# EAGLE design Grove - I2C Color sensor v1.2 (EAGLE 6.3)
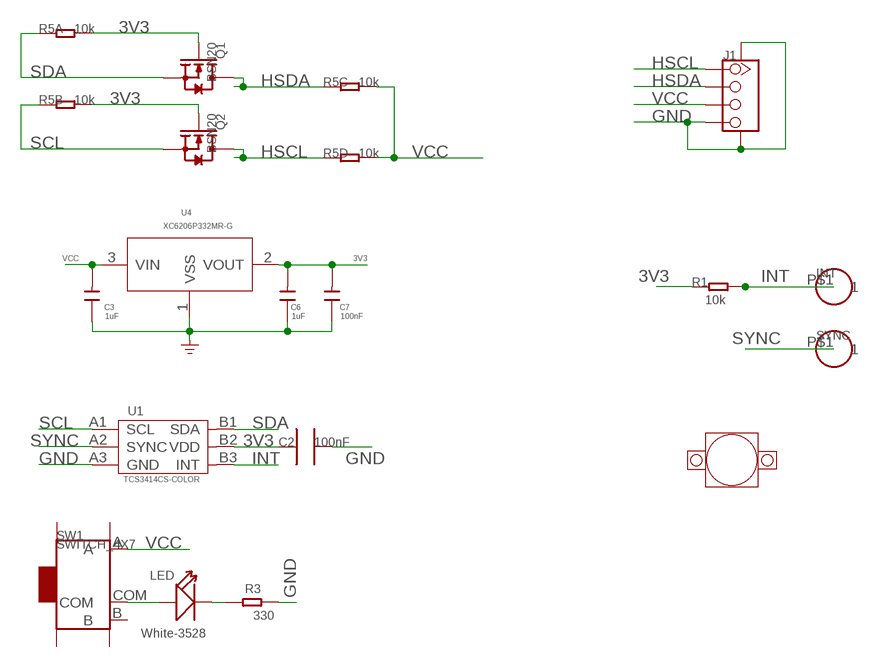
[diagram p0: schematic, sheet 1]

## Parts
C2  100nF  C0603_S  [0603_S]
C3  1uF  C-0603  [C0603]
C6  1uF  C-0603  [C0603]
C7  100nF  C-0603  [C0603]
INT  CK_1X132  [CK_1X1]
J1  TWIG-4P-2.0-SMD-FEMALE-REINFORCE'DD'  [4P-SMD-2.0]
LED  White-3528  007-LED1.6*2.7  [LED1210]
Q1  BSN20  MOSFET-N'SOT23'  [SOT23]
Q2  BSN20  MOSFET-N'SOT23'  [SOT23]
R1  10k  R0603  [0603]
R3  330  R0603  [0603]
R5  10k  005-4R_1206  [R1206-8]
SW1  SWITCH_4X7  [4*8_SW]
SYNC  CK_1X132  [CK_1X1]
U1  TCS3414CS-COLOR  [TCS3414CS]
U3  LENS_HOOD  [LENS_HOOD]
U4  XC6206P332MR-G  XC6206MR  [SOT23]

## Nets
3V3: C2.1 C6.2 C7.2 Q1.1(G) Q2.1(G) R1.1 R5.7 R5.8 U1.B2(VDD) U4.2(VOUT)
GND: C2.2 C3.1 C6.1 C7.1 J1.4 J1.SS1 J1.SS2 R3.1 U1.A3(GND) U4.1(VSS)
HSCL: J1.1 Q2.3(D) R5.4
HSDA: J1.2 Q1.3(D) R5.3
INT: INT.P$1 R1.2 U1.B3(INT)
N$2: LED.1(+) SW1.COM
N$5: LED.2(-) R3.2
SCL: Q2.2(S) R5.2 U1.A1(SCL)
SDA: Q1.2(S) R5.1 U1.B1(SDA)
SYNC: SYNC.P$1 U1.A2(SYNC)
VCC: C3.2 J1.3 R5.5 R5.6 SW1.A U4.3(VIN)
Unconnected: SW1.B SW1.SS1 SW1.SS2 SW1.SS3 SW1.SS4

## Library data of the parts
C2 = CPT_SMD:C0603
C3 C6 C7 = Discrete:C*: Ceramic Capacitors
INT SYNC = CONNECTER1:CK_1X1
J1 = Connector:TWIG-4P-2.0-SMD-FEMALE-REINFORCE
LED = Discrete:007-LED*
Q1 Q2 = Discrete:MOSFET-N: IRLL014: http://www.vishay.com/docs/91319/sihll014.pdf
R1 R3 = CPT_SMD1:R0603
R5 = Discrete:005-4R*: Resistor Array
SW1 = CPT_SMD:SWITCH
U1 = sensor:TCS3414CS-COLOR
U3 = machine:LENS_HOOD
U4 = IC:XC6206: LOW ESR Cap.Compatible Positive Voltage Regulators

## Board
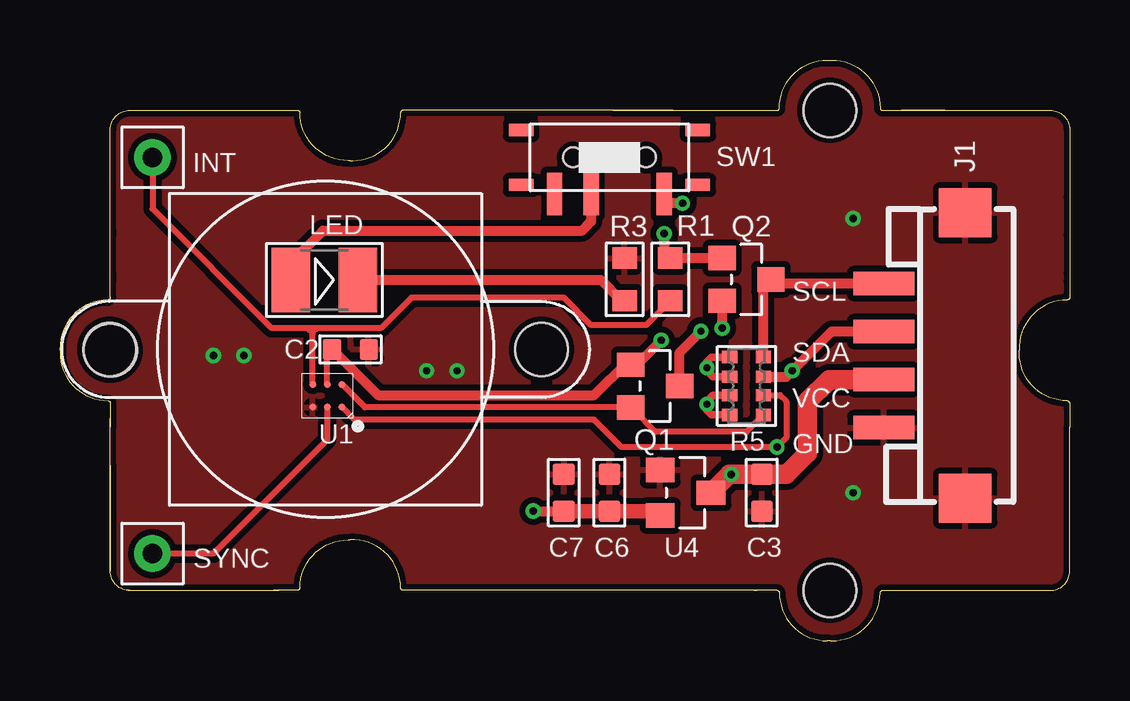
[diagram p1: board, top side]
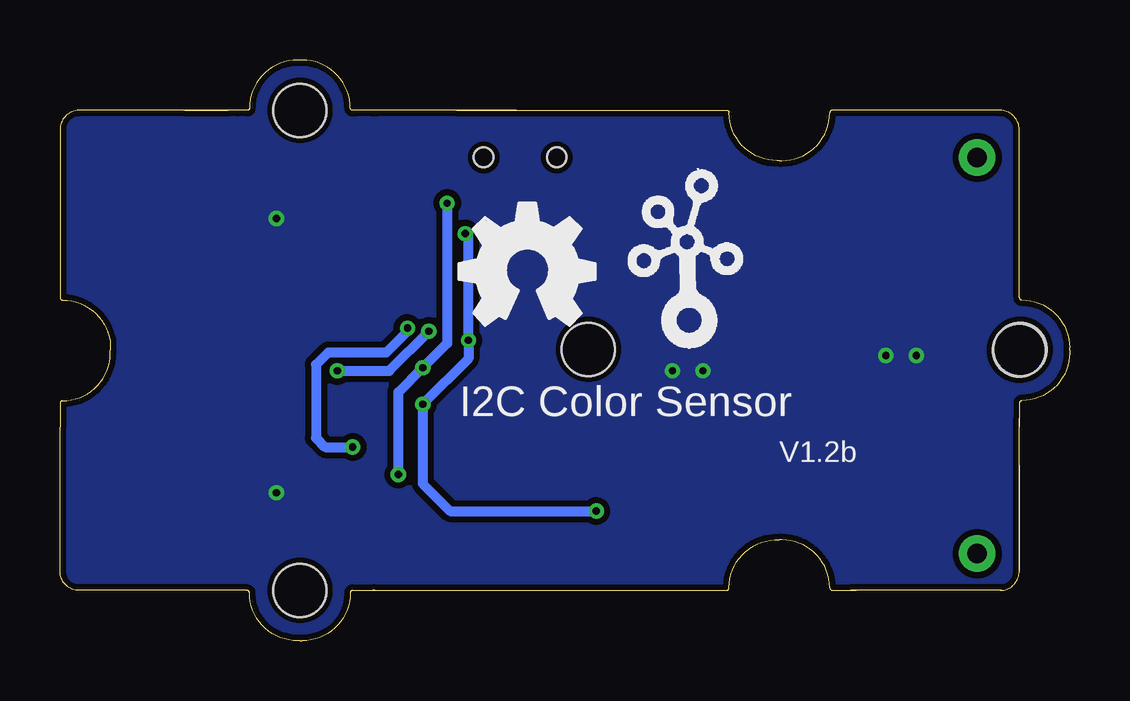
[diagram p2: board, bottom side, seen from below]

Size 42.09 x 24.2 mm. Coordinates in mm from the lower left corner, seen from the top.
Copper layers (1*16): Top 0.035mm / dielectric 1.5mm / Bottom 0.035mm
Design rules "default *": minimum track width 6mil, minimum drill 12mil, track to track 6mil, track to pad 6mil, pad to pad 6mil, via to via 6mil, smd to smd 0mil, copper to edge 10mil, drill to drill 10mil, minimum pad ring 10mil, minimum via ring 6mil, stop-mask expansion 2mil, vias tented up to drill 100mil, thermal gap 10mil

### Footprints (pad centres in the part's own frame; a part is rotated, then mirrored left to right if it is on the bottom)
0603_S = smd 0.762 x 0.889: 1 -0.762,0; 2 0.762,0
C0603 = smd 0.889 x 0.889: 1 -0.762,0; 2 0.762,0
CK_1X1 = drill 0.813 pad 1.524: P$1 0,0
4P-SMD-2.0 = smd 0.965 x 2.54: 1 -3,0; 2 -1,0; 3 1,0; 4 3,0 | smd 2.032 x 2.184: SS1 -5.946,3.4; SS2 5.946,3.4
LED1210 = smd 1.6 x 2.7: 1 -1.4,0; 2 1.4,0
SOT23 = smd 1.016 x 1.143: 1 -0.889,-1.016; 2 0.889,-1.016; 3 0,1.016
0603 = smd 0.889 x 1.016: 1 -0.889,0; 2 0.889,0
R1206-8 = smd 0.508 x 0.635: 1 -1.206,-0.699; 2 -0.381,-0.699; 3 0.381,-0.699; 4 1.206,-0.699; 5 1.206,0.699; 6 0.381,0.699; 7 -0.381,0.699; 8 -1.206,0.699
4*8_SW = smd 1.778 x 0.635: A 1.524,2.286; B 1.524,-2.286; COM 1.524,-0.762 | smd 0.508 x 1.016: SS1 -1.143,-3.683; SS2 1.143,-3.683; SS3 1.143,3.683; SS4 -1.143,3.683 | hole 0.813: 0,-1.524; 0,1.524
TCS3414CS = smd 0.3 x 0.3: A1 -0.61,0.475; A2 0,0.475; A3 0.61,0.475; B1 -0.61,-0.475; B2 0,-0.475; B3 0.61,-0.475
LENS_HOOD = hole 2.2: 9,0; -9,0
SOT23' = smd 1.016 x 1.2: 1 -0.95,-1.06; 2 0.95,-1.06; 3 0,1.06
2U-DIM-W/-DRILL = hole 2.2: 10.453,-10.42; 10.453,9.58; -19.535,-0.415

### Placement (x,y rotation side)
C2  12.11,12.14 0 top
C3  29.26,6.17 90 top
C6  22.91,6.17 270 top
C7  21,6.17 270 top
INT  3.86,20.14 270 top
J1  34.34,11.88 270 top
LED  11.02,15.03 0 top
Q1  24.81,10.62 270 top
Q2  28.62,15.06 270 top
R1  25.45,15.06 270 top
R3  23.54,15.06 270 top
R5  28.62,10.62 90 top
SW1  22.91,20.14 270 top
SYNC  3.86,3.63 270 top
U1  11.14,10.21 180 top
U3  11.07,12.14 0 top
U4  XC6206P332MR-G  [SOT23']  26.08,6.17 270 top
U$1  [TWIGLOGO]  15.92,13.15 0 bottom
U$2  [2U-DIM-W/-DRILL]  21.64,12.52 0 top
U$3  [OSHW_FILLX200_NOTEXT]  25.45,13.15 0 bottom

### Tracks (layer width: path | path; a pad name or v marks a point on that pad's centre or on a via)
3V3  (via drill 0.3 pad 0.64)
  Top 0.254: U1.B2 11.15,11.94 C2.1
  Top 0.305: R5.8 27.16,9.41 26.97,9.6 v26.97,9.85 26.97,9.98 27.22,10.23 R5.7
  Top 0.406: 23.67,11.5 Q1.1 23.92,11.5 | C2.1 13.25,10.23 22.27,10.23 23.67,11.63 23.79,11.63 23.92,11.5 | Q2.1 R1.1 25.19,15.95 v25.19,16.96 | 23.92,11.5 24.05,11.5 v25.06,12.52 | v19.73,5.41 C7.2
  Top 0.61: U4.2 25.08,5.28 25.19,5.28 25.06,5.41 C6.2 C7.2
  Bottom 0.406: v25.19,16.96 25.06,16.84 v25.06,12.52 25.06,11.76 v26.97,9.85 26.97,6.55 25.83,5.41 v19.73,5.41
GND  (via drill 0.3 pad 0.64)
  other vias: 15.29,11.25 16.55,11.25 6.4,11.88 7.67,11.88 33.06,17.6 33.06,6.17
  pour Bottom (isolate 0.254): -1.22,-0.18 42.59,-0.18 42.59,24.59 -1.22,24.59
  pour Top (isolate 0.254): 31.8,-0.18 42.59,-0.18 42.59,24.59 -0.59,24.59 -0.59,-0.18 31.67,-0.18
HSCL
  Top 0.406: J1.1 29.81,14.88 Q2.3 29.32,14.74 R5.4
HSDA  (via drill 0.3 pad 0.64)
  Top 0.406: J1.2 32.16,12.88 v30.53,11.25 30.27,11 R5.3 | Q1.3 25.83,12.01 v26.72,12.9
  Bottom 0.406: v30.53,11.25 28.37,11.25 v26.72,12.9
INT
  Top 0.254: INT.P$1 3.86,18 8.83,13.03 10.33,13.03 | R1.2 24.43,13.15 22.14,13.15 21,14.3 14.65,14.3 13.38,13.03 10.71,13.03 | 10.71,13.03 10.59,13.03 | 10.59,13.03 10.33,13.03 | U1.B3 10.54,12.79 10.54,12.82 | 10.54,12.82 10.54,12.98 10.59,13.03 | 10.54,12.82 10.33,13.03 | 10.54,12.82 10.54,12.85 10.71,13.03
N$2
  Top 0.406: LED.1 9.62,15.74 10.97,17.09 21.76,17.09 21.95,17.28 22.14,17.47 SW1.COM
N$5
  Top 0.406: LED.2 22.55,15.04 23.41,14.17 R3.2
SCL  (via drill 0.3 pad 0.64)
  Top 0.254: R5.2 30.02,10.23 30.27,9.98 30.27,8.46 v29.89,8.07 23.41,8.07 22.27,9.22 12.27,9.22 U1.A1
  Top 0.406: Q2.2 v27.6,13.03
  Bottom 0.406: v27.6,13.03 27.6,12.9 28.49,12.01 30.91,12.01 31.41,11.5 31.41,8.46 31.03,8.07 v29.89,8.07
SDA
  Top 0.254: U1.B1 12.71,9.73 Q1.2 23.79,9.85 23.92,9.73 23.92,9.6 24.81,8.71 28.62,8.71 R5.1
SYNC
  Top 0.254: U1.A2 11.15,8.38 6.4,3.63 SYNC.P$1
VCC  (via drill 0.3 pad 0.64)
  Top 0.305: 25.06,18.74 SW1.A | R5.6 27.22,11 26.97,11.25 v26.97,11.38 26.97,11.63 27.16,11.82 R5.5
  Top 0.406: v25.95,18.23 25.32,18.23 25.19,18.36 SW1.A
  Top 0.813: J1.3 32.06,10.88 31.16,9.98 31.16,7.82 30.27,6.93 C3.2 v27.98,6.93 27.9,6.93 U4.3
  Bottom 0.406: v25.95,18.23 25.95,12.39 v26.97,11.38 27.98,10.36 v27.98,6.93

### Text on the board
tPlace: SCL | SDA | VCC | GND
bPlace: I2C Color Sensor | V1.2b